# EAGLE design CSR8645-VFBGA275um-V1 (EAGLE 7.2.0)
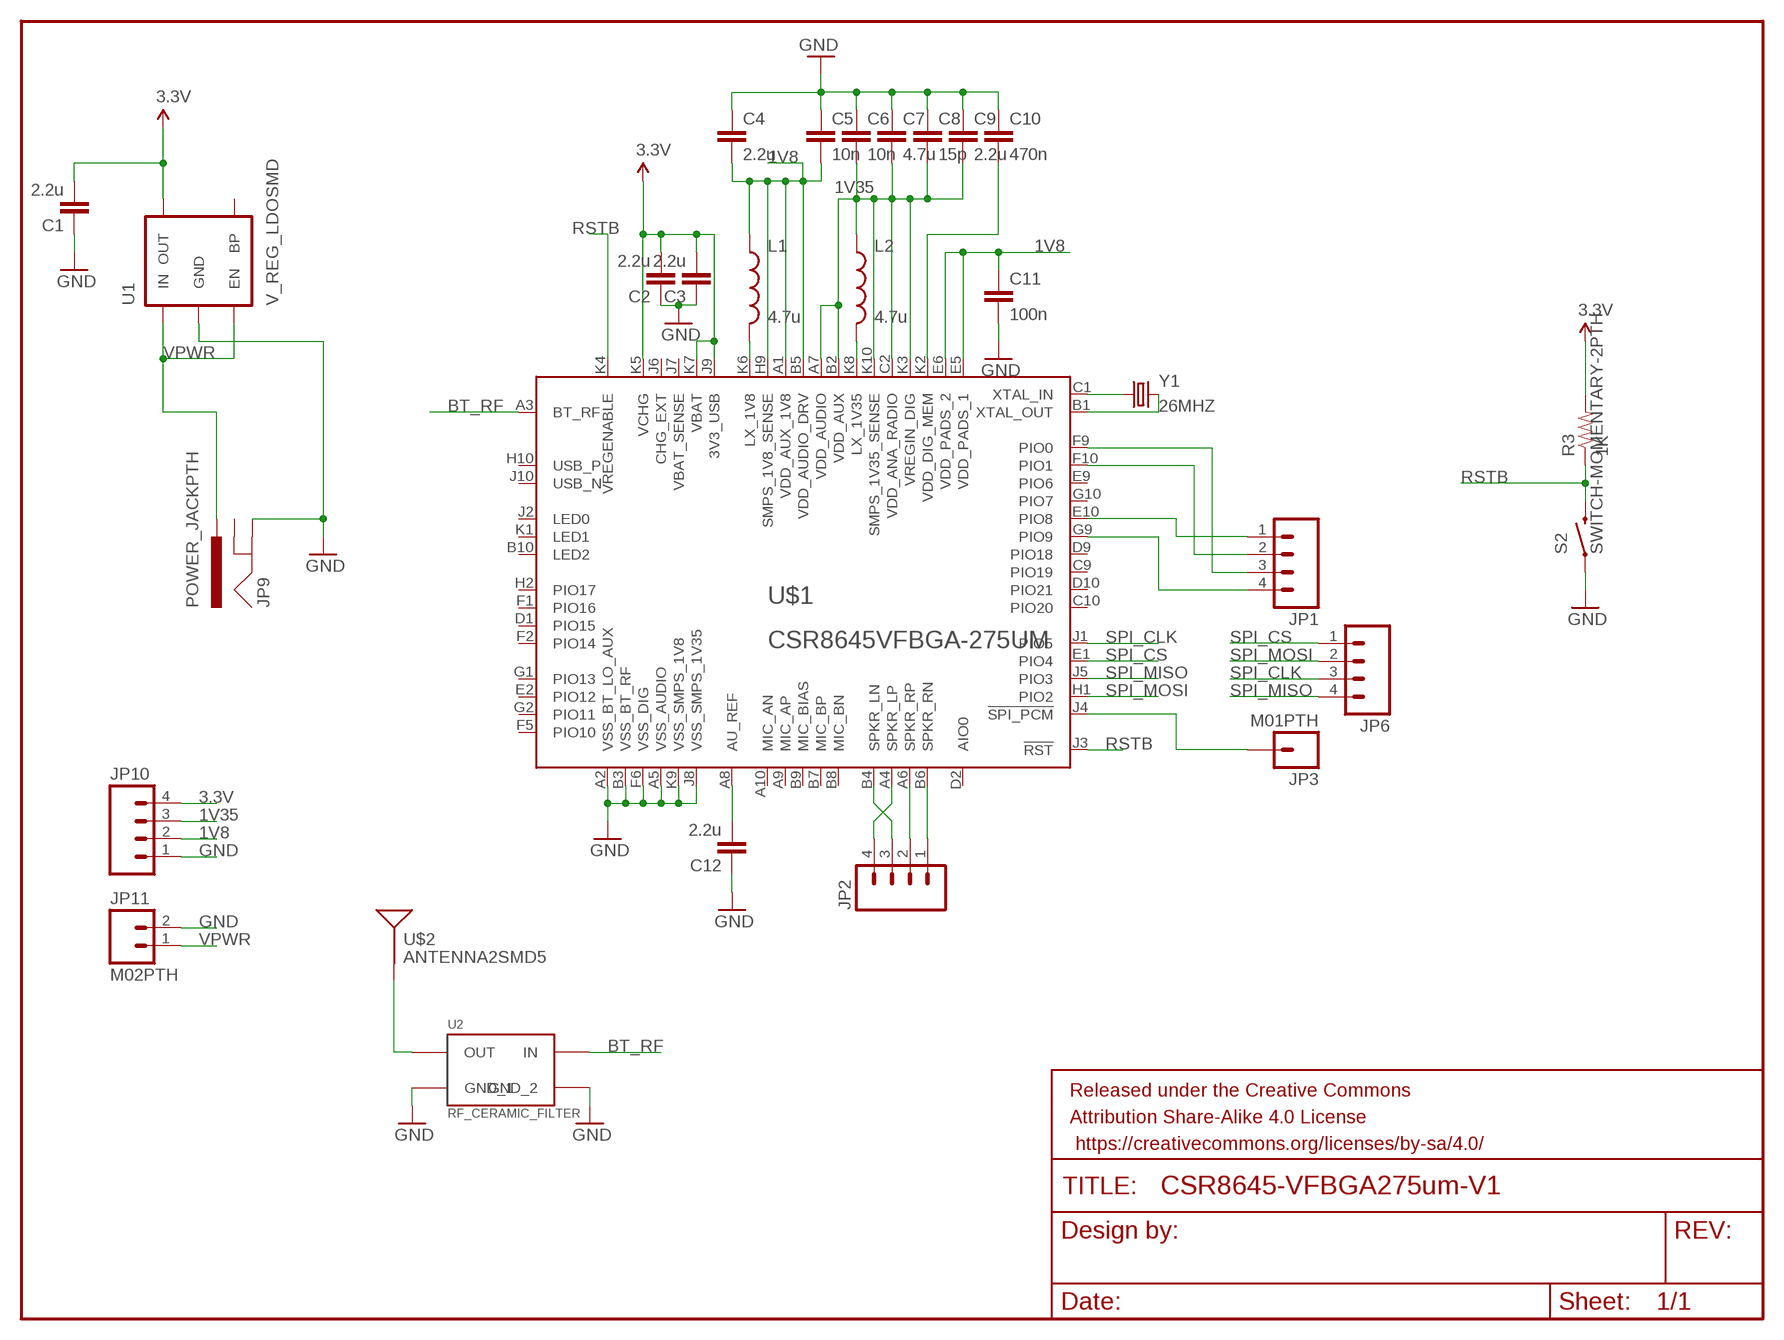
[diagram p0: schematic, sheet 1]

## Parts
C1  2.2u  CAPPTH  [CAP-PTH-SMALL]
C2  2.2u  CAPPTH  [CAP-PTH-SMALL]
C3  2.2u  CAPPTH  [CAP-PTH-SMALL]
C4  2.2u  CAPPTH  [CAP-PTH-SMALL]
C5  10n  CAPPTH  [CAP-PTH-SMALL]
C6  10n  CAPPTH  [CAP-PTH-SMALL]
C7  4.7u  CAPPTH  [CAP-PTH-SMALL]
C8  15p  CAPPTH  [CAP-PTH-SMALL]
C9  2.2u  CAPPTH  [CAP-PTH-SMALL]
C10  470n  CAPPTH  [CAP-PTH-SMALL]
C11  100n  CAPPTH  [CAP-PTH-SMALL]
C12  2.2u  CAPPTH  [CAP-PTH-SMALL]
FRAME1  FRAME-LETTER  [CREATIVE_COMMONS]
JP1  M04PTH  [1X04]
JP2  M04PTH  [1X04]
JP3  M01PTH  [1X01]
JP6  M04PTH  [1X04]
JP9  POWER_JACKPTH  [POWER_JACK_PTH]
JP10  M04PTH  [1X04]
JP11  M02PTH  [1X02]
L1  4.7u  INDUCTOR0805  [0805]
L2  4.7u  INDUCTOR0805  [0805]
R3  1K  RESISTOR0805-RES  [0805]
S2  SWITCH-MOMENTARY-2PTH  [TACTILE-PTH]
U1  V_REG_LDOSMD  [SOT23-5]
U2  RF_CERAMIC_FILTER  [RF_FILTER]
U$1  CSR8645VFBGA-275UM  [VFBGA68-LARGE]
U$2  ANTENNA2SMD5  [ANTENNA-CHIP5]
Y1  26MHZ  CRYSTALHC49US  [HC49US]

## Nets
1V8: C4.2 C5.2 C11.1 JP10.2 L1.1 U$1.A1(VDD_AUX_1V8) U$1.B5(VDD_AUDIO_DRV) U$1.E5(VDD_PADS_1) U$1.E6(VDD_PADS_2) U$1.H9(SMPS_1V8_SENSE)
1V35: C6.2 C7.2 C8.2 C9.2 JP10.3 L2.1 U$1.A7(VDD_AUDIO) U$1.B2(VDD_AUX) U$1.C2(VDD_ANA_RADIO) U$1.K3(VREGIN_DIG) U$1.K10(SMPS_1V35_SENSE)
3.3V: C1.2 C2.2 C3.2 JP10.4 R3.2 U1.5(OUT) U$1.J9(3V3_USB) U$1.K5(VCHG) U$1.K7(VBAT)
!SPI_PCM: JP3.1 U$1.J4(!SPI_PCM)
BT_RF: U2.4(IN) U$1.A3(BT_RF)
GND: C1.1 C2.1 C3.1 C4.1 C5.1 C6.1 C7.1 C8.1 C9.1 C10.1 C11.2 C12.1 JP9.GND JP10.1 JP11.2 S2.1 U1.2(GND) U2.1(GND_1) U2.3(GND_2) U$1.A2(VSS_BT_LO_AUX) U$1.A5(VSS_AUDIO) U$1.B3(VSS_BT_RF) U$1.F6(VSS_DIG) U$1.J8(VSS_SMPS_1V35) U$1.K9(VSS_SMPS_1V8)
N$1: JP1.3 U$1.F9(PIO0)
N$2: JP2.3 U$1.B4(SPKR_LN)
N$3: L1.2 U$1.K6(LX_1V8)
N$4: L2.2 U$1.K8(LX_1V35)
N$5: U$1.C1(XTAL_IN) Y1.1
N$6: C10.2 U$1.K2(VDD_DIG_MEM)
N$7: U$1.B1(XTAL_OUT) Y1.2
N$8: JP1.2 U$1.F10(PIO1)
N$9: JP1.1 U$1.E10(PIO8)
N$10: JP2.4 U$1.A4(SPKR_LP)
N$11: JP1.4 U$1.G9(PIO9)
N$12: JP2.2 U$1.A6(SPKR_RP)
N$13: U2.2(OUT) U$2.FEED(SIGNAL)
N$14: JP2.1 U$1.B6(SPKR_RN)
N$15: C12.2 U$1.A8(AU_REF)
RSTB: R3.1 S2.3 U$1.J3(!RST) U$1.K4(VREGENABLE)
SPI_CLK: JP6.3 U$1.J1(PIO5)
SPI_CS: JP6.1 U$1.E1(PIO4)
SPI_MISO: JP6.4 U$1.J5(PIO3)
SPI_MOSI: JP6.2 U$1.H1(PIO2)
VPWR: JP9.PWR JP11.1 U1.1(IN) U1.3(EN)
Unconnected: JP9.GNDBREAK U1.4(BP) U$1.A9(MIC_AP) U$1.A10(MIC_AN) U$1.B7(MIC_BP) U$1.B8(MIC_BN) U$1.B9(MIC_BIAS) U$1.B10(LED2) U$1.C9(PIO19) U$1.C10(PIO20) U$1.D1(PIO15) U$1.D2(AIO0) U$1.D9(PIO18) U$1.D10(PIO21) U$1.E2(PIO12) U$1.E9(PIO6) U$1.F1(PIO16) U$1.F2(PIO14) U$1.F5(PIO10) U$1.G1(PIO13) U$1.G2(PIO11) U$1.G10(PIO7) U$1.H2(PIO17) U$1.H10(USB_P) U$1.J2(LED0) U$1.J6(CHG_EXT) U$1.J7(VBAT_SENSE) U$1.J10(USB_N) U$1.K1(LED1)

## Library data of the parts
C1-C12 = SparkFun-Passives:CAP: Capacitor Standard 0603 ceramic capacitor, and 0.1" leaded capacitor.
FRAME1 = SparkFun-Aesthetics:FRAME-LETTER: Schematic Frame Standard 8.5x11 US Letter frame
JP1 JP2 JP6 JP10 = SparkFun-Connectors:M04: Header 4 Standard 4-pin 0.1" header. Use with straight break away headers (SKU : PRT-00116), right angle break away headers (PRT-00553), swiss pins (PRT-00743), machine pins (PRT-00117), and female headers (PRT-00115). Molex polarized connector foot print use with SKU : PRT-08231 with associated crimp pins and housings. 1MM SMD Version SKU: PRT-10208
JP3 = SparkFun-Connectors:M01: Header 1 Standard 1-pin 0.1" header. Use with straight break away headers (SKU : PRT-00116), right angle break away headers (PRT-00553), swiss pins (PRT-00743), machine pins (PRT-00117), and female headers (PRT-00115).
JP9 = SparkFun-Connectors:POWER_JACK: Power Jack This is the standard 5.5mm barrel jack for power. The PTH is the most common, proven, reliable, footprint. The Slot footprint only works if the mill layer is transmitted to the PCB fab house so be warned. Mating wall wart : TOL-00298 (and others); PROD_ID: CONN-08197
JP11 = SparkFun-Connectors:M02: Standard 2-pin 0.1" header. Use with - straight break away headers ( PRT-00116) - right angle break away headers (PRT-00553) - swiss pins (PRT-00743) - machine pins (PRT-00117) - female headers (PRT-00115) Molex polarized connector foot print use with: PRT-08233 with associated crimp pins and housings. 2.54_SCREWTERM for use with PRT-10571. 3.5mm Screw Terminal footprints for PRT-08084 5mm Screw Terminal footprints for use with PRT-08432
L1 L2 = SparkFun-Passives:INDUCTOR: Inductors Basic Inductor/Choke - 0603 and 1206. Footprints are not proven and vary greatly between part numbers. SRN6045- 33uH, 20% 1.4A SDR0403-560KL - 56uH, 10%, 500mA RMS/740mA peak
R3 = SparkFun-Resistors:RESISTOR: Resistor Basic schematic elements and footprints for 0603, 1206, and PTH resistors.
S2 = SparkFun-Electromechanical:SWITCH-MOMENTARY-2: Various NO switches- pushbuttons, reed, etc
U1 = SparkFun-PowerIC:V_REG_LDO: Voltage Regulator LDO Standard 150mA LDO voltage regulator in SOT-23 layout. Micrel part MIC5205. BP (by-pass) pin is used to lower output noise with 470pF cap.
U2 = SparkFun-RF:RF_CERAMIC_FILTER
U$1 = SparkFun-DigitalIC:CSR8645
U$2 = SparkFun-RF:ANTENNA2: Chip antenna Single endded antenna. Common with smaller chip antennas. CHIP4 package is the GPS Chip Antenna SKU: GPS-08418. CHIP5 package is 2.4GHz chip antenna SKU: WRL-00144.
Y1 = SparkFun-FreqCtrl:CRYSTAL: Various standard crystals. Proven footprints.

## Board
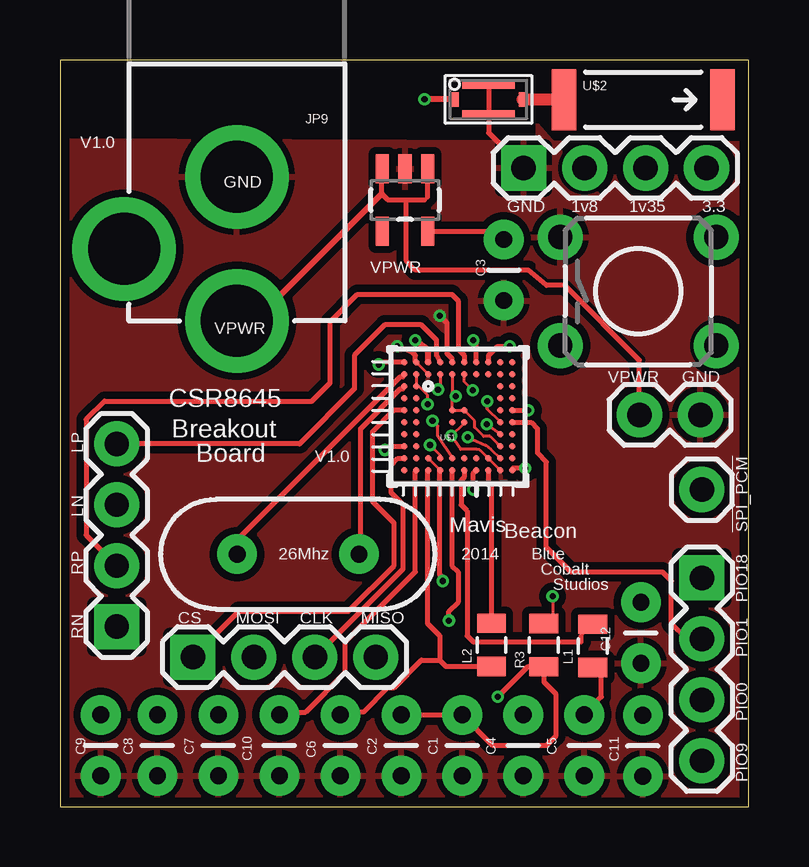
[diagram p1: board, top side]
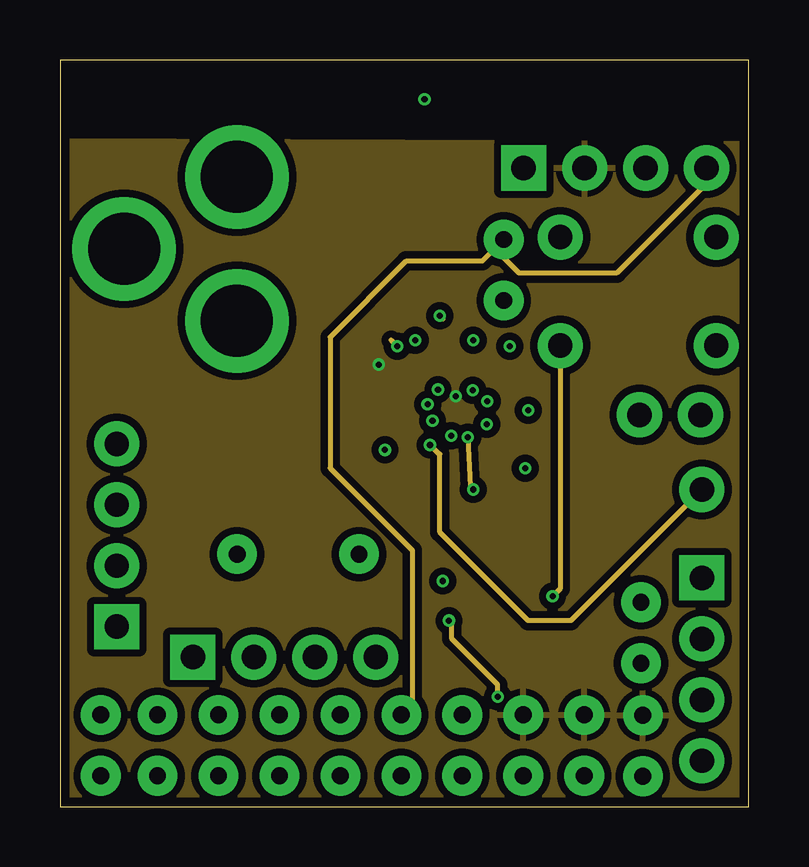
[diagram p2: board, inner layer Route2]
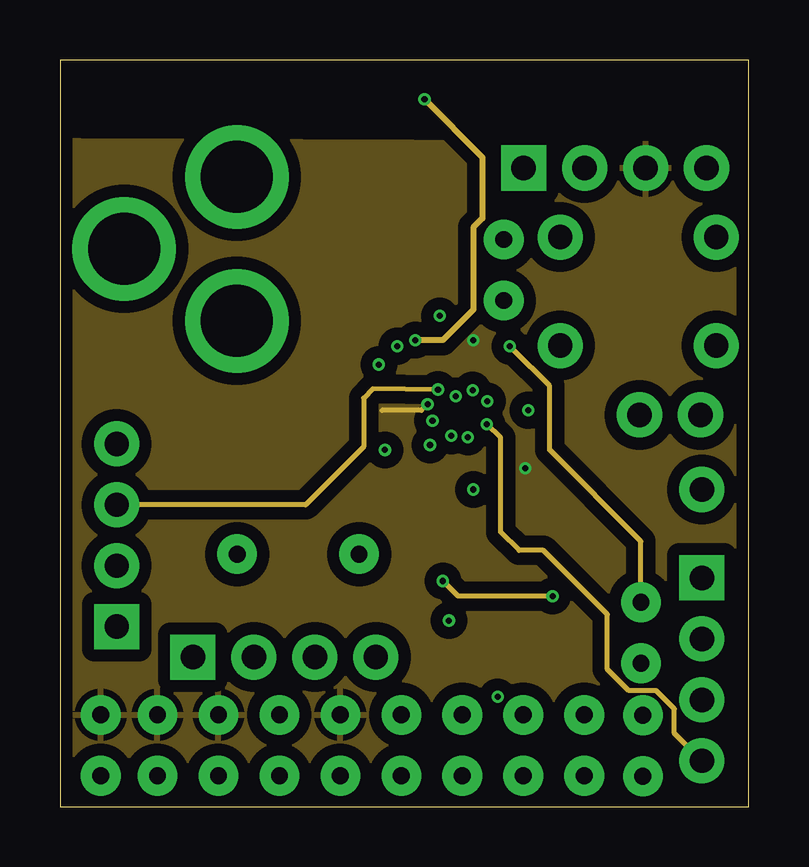
[diagram p3: board, inner layer Route15]
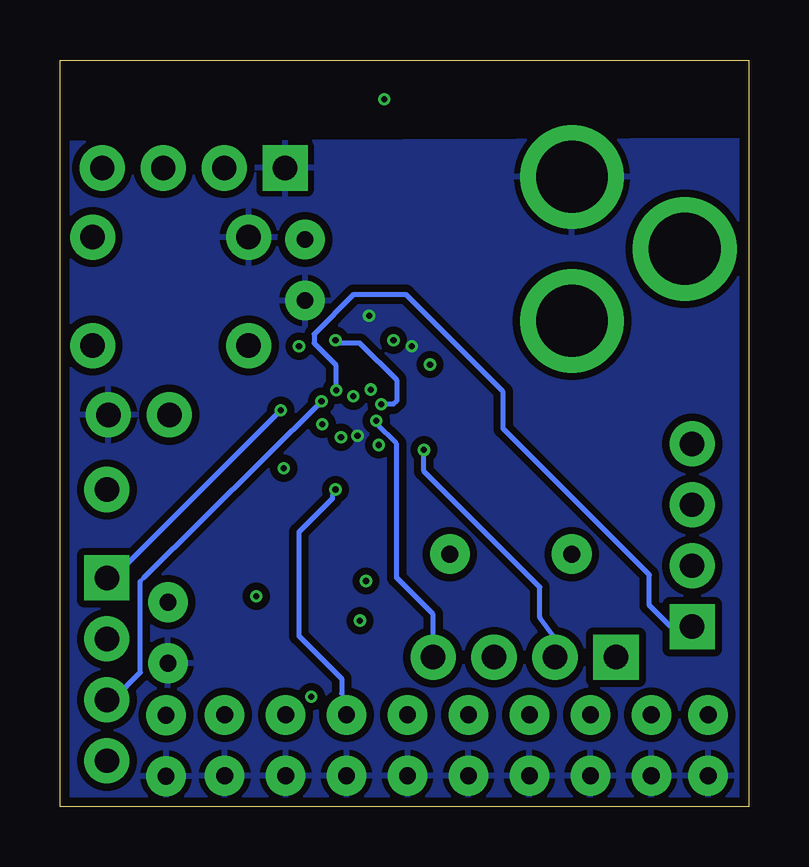
[diagram p4: board, bottom side, seen from below]

Size 28.7 x 31.11 mm. Coordinates in mm from the lower left corner, seen from the top.
Outline: 0,0 28.7,0 28.7,31.11 0,31.11 0,0
Copper layers (1*2*15*16): Top 0.035559375mm / dielectric 0.17018125mm / Route2 0.01778125mm / dielectric 47mil / Route15 0.01778125mm / dielectric 0.17018125mm / Bottom 0.035559375mm
Design rules "OSHPark-4layer *": minimum track width 5mil, minimum drill 10mil, track to track 6mil, track to pad 6mil, pad to pad 5mil, via to via 5mil, smd to smd 5mil, copper to edge 15mil, drill to drill 6mil, minimum pad ring 4mil, minimum via ring 5mil, stop-mask expansion 4mil, vias tented up to drill 25mil, thermal gap 10mil

### Footprints (pad centres in the part's own frame; a part is rotated, then mirrored left to right if it is on the bottom)
CAP-PTH-SMALL = drill 0.7 pad 1.651: 1 0,0; 2 2.54,0
1X04 = drill 1.016 pad 1.88 square: 1 0,0 | drill 1.016 pad 1.88: 2 2.54,0; 3 5.08,0; 4 7.62,0
1X01 = drill 1.016 pad 1.88: 1 0,0
POWER_JACK_PTH = drill 2.997 pad 4.318: GND 0,7.7; GNDBREAK 4.7,10.7; PWR 0,13.7
1X02 = drill 1.016 pad 1.88: 1 0,0; 2 2.54,0
0805 = smd 0.8 x 1.2: 1 -0.9,0; 2 0.9,0
TACTILE-PTH = drill 1.016 pad 1.88: 1 -3.251,2.261; 2 3.251,2.261; 3 -3.251,-2.261; 4 3.251,-2.261
SOT23-5 = smd 0.55 x 1.2: 1 -0.95,-1.3; 2 0,-1.3; 3 0.95,-1.3; 4 0.95,1.3; 5 -0.95,1.3
RF_FILTER = smd 2.2 x 0.35: 1 0,0.625; 3 0,-0.625 | smd 0.35 x 0.6: 2 1.425,0; 4 -1.425,0
VFBGA68-LARGE = smd 0.275 x 0.275: A1 -2.25,2.25; A2 -1.75,2.25; A3 -1.25,2.25; A4 -0.75,2.25; A5 -0.25,2.25; A6 0.25,2.25; A7 0.75,2.25; A8 1.25,2.25; A9 1.75,2.25; A10 2.25,2.25; B1 -2.25,1.75; B2 -1.75,1.75; B3 -1.25,1.75; B4 -0.75,1.75; B5 -0.25,1.75; B6 0.25,1.75; B7 0.75,1.75; B8 1.25,1.75; B9 1.75,1.75; B10 2.25,1.75; C1 -2.25,1.25; C2 -1.75,1.25; C9 1.75,1.25; C10 2.25,1.25; D1 -2.25,0.75; D2 -1.75,0.75; D9 1.75,0.75; D10 2.25,0.75; E1 -2.25,0.25; E2 -1.75,0.25; E5 -0.25,0.25; E6 0.25,0.25; E9 1.75,0.25; E10 2.25,0.25; F1 -2.25,-0.25; F2 -1.75,-0.25; F5 -0.25,-0.25; F6 0.25,-0.25; F9 1.75,-0.25; F10 2.25,-0.25; G1 -2.25,-0.75; G2 -1.75,-0.75; G9 1.75,-0.75; G10 2.25,-0.75; H1 -2.25,-1.25; H2 -1.75,-1.25; H9 1.75,-1.25; H10 2.25,-1.25; J1 -2.25,-1.75; J2 -1.75,-1.75; J3 -1.25,-1.75; J4 -0.75,-1.75; J5 -0.25,-1.75; J6 0.25,-1.75; J7 0.75,-1.75; J8 1.25,-1.75; J9 1.75,-1.75; J10 2.25,-1.75; K1 -2.25,-2.25; K2 -1.75,-2.25; K3 -1.25,-2.25; K4 -0.75,-2.25; K5 -0.25,-2.25; K6 0.25,-2.25; K7 0.75,-2.25; K8 1.25,-2.25; K9 1.75,-2.25; K10 2.25,-2.25
ANTENNA-CHIP5 = smd 1.016 x 2.54: FEED -3.302,0; NC 3.302,0
HC49US = drill 0.7 pad 1.651: 1 -2.54,0; 2 2.54,0

### Placement (x,y rotation side)
C1  16.76,1.28 90 top
C2  14.22,1.28 90 top
C3  18.49,21.08 90 top
C4  19.3,1.28 90 top
C5  21.84,1.28 90 top
C6  11.68,1.28 90 top
C7  6.6,1.28 90 top
C8  4.06,1.28 90 top
C9  1.7,1.28 90 top
C10  9.14,1.28 90 top
C11  24.28,3.8 270 top
C12  24.21,5.97 90 top
FRAME1  120.47,86.87 0 top  (outside the outline)
JP1  26.75,9.53 270 top
JP2  2.36,7.49 90 top
JP3  26.75,13.21 0 top
JP6  5.54,6.22 0 top
JP9  7.37,33.94 180 top
JP10  19.32,26.61 0 top
JP11  24.15,16.32 0 top
L1  22.2,6.69 90 top
L2  17.98,6.73 90 top
R3  20.16,6.72 270 top
S2  24.09,21.46 0 top
U1  14.38,25.27 180 top
U2  17.86,29.46 0 top
U$1  16.59,16.26 0 top
U$2  24.31,29.45 0 top
Y1  9.92,10.52 180 top

### Tracks (layer width: path | path; a pad name or v marks a point on that pad's centre or on a via)
1V8  (via drill 0.25 pad 0.1)
  Top 0.127: U$1.E6 U$1.E5 16.34,16.95 v16.48,17.09 16.34,17.24 U$1.B5 | U$1.E6 16.84,16.51 | 18.23,15.11 U$1.H9 17.92,15.42 17.65,15.42 17.27,15.8 17.27,16.07 U$1.E6 | 22.56,5.43 L1.1
  Top 0.203: C5.2 21.92,3.94 22.56,4.57 22.56,5.43 | 22.56,5.69 L1.1 | U$1.A1 13.38,18.51 v13.28,18.41
  pour Route2 (isolate 0.305): 0.08,27.81 28.65,27.69 28.65,0 0.2,0
1V35  (via drill 0.25)
  Top 0.127: U$1.B2 U$1.C2 14.94,17.53 15.32,17.14 v15.32,16.76 | 17.35,18.54 U$1.A7
  Top 0.203: v19.38,14.1 18.87,14.1 U$1.K10 | L2.1 17.35,5.84 16.08,5.84 15.82,6.1 | C6.2 11.76,3.94 12.65,3.94 13.67,4.95 13.92,4.95 15.06,6.1 15.82,6.1 | 15.82,6.1 15.82,7.11 15.32,7.62 15.32,13.99 U$1.K3 | 17.35,18.54 17.35,19.3 v17.22,19.43
  Route15 0.203: v15.32,16.76 15.06,16.51 13.41,16.51
  Bottom 0.203: v15.32,16.76 14.81,16.76 14.68,16.89 14.68,17.78 16.21,19.3 17.09,19.3 v17.22,19.43
  pour Route15 (isolate 0.508): 0.84,27.81 28.65,27.69 28.65,-0.13 0.2,-0.13 0.2,27.81
3.3V  (via drill 0.25, 0.25 pad 0.1)
  Top 0.127: 14.3,3.81 C2.2 | 16.71,3.81 C1.2 | v16.99,15.39 17.73,15.06 17.96,14.88 U$1.J9
  Top 0.203: v17.22,13.21 17.22,13.89 U$1.K7 | 16.71,3.81 14.3,3.81 | C1.2 18.04,2.54 20.27,2.54 20.65,2.92 20.65,4.7 20.16,5.19 R3.2 19.49,5.82 v18.24,4.57 | U1.5 18.14,23.97 C3.2 | v16.21,7.75 16.21,8.13 16.59,8.51 16.59,9.78 16.33,10.03 16.33,13.97 16.34,13.97 U$1.K5
  Route2 0.127: 17.09,13.33 v17.22,13.21 | JP10.4 26.94,25.97
  Route2 0.203: v16.99,15.39 17.09,13.33 | 26.94,25.97 23.19,22.22 19.13,22.22 18.49,22.86 C3.2 17.6,22.73 14.43,22.73 11.25,19.56 11.25,14.1 14.68,10.67 14.68,4.32 14.22,3.86 C2.2 | v18.24,4.57 18.24,5.08 16.33,6.98 16.33,7.62 v16.21,7.75
  Bottom 0.127: 16.97,4.7 16.84,4.57
  Bottom 0.203: 16.84,4.57 16.84,3.94 C1.2 | 16.97,4.7 16.97,5.33 18.75,7.11 18.75,11.43 17.35,12.83 17.35,12.95 17.22,13.08 v17.22,13.21
!SPI_PCM  (via drill 0.25)
  Top 0.127: v15.42,15.06 15.84,14.64 U$1.J4
  Route2 0.203: JP3.1 21.29,7.75 19.51,7.75 15.82,11.43 15.82,14.68 15.8,14.68 v15.42,15.06
BT_RF  (via drill 0.25)
  Top 0.254: U2.4 v15.19,29.46 | v14.81,19.43 15.32,19.05 15.32,18.53 U$1.A3
  Route15 0.254: v15.19,29.46 17.6,27.05 17.6,24.51 17.22,24.13 17.22,20.7 15.95,19.43 v14.81,19.43
GND  (via drill 0.25, 0.25 pad 0.1)
  Top 0.127: U$1.J8 | U$1.F6 | U$1.B3 U$1.A2 14.81,18.53 | U$1.J8 U$1.K9 | U$1.F6 | U1.2 14.38,26.59 14.3,26.67 | U$1.J8 17.48,14.86 17.37,14.88 16.69,14.88 v16.31,15.44 | v16.31,15.44 16.84,15.97 U$1.F6 | v16.31,15.44 16.33,15.42 | 16.31,15.39 v16.31,15.44
  Top 0.203: U2.1 U2.3 17.86,28.07 JP10.1 | 14.81,18.53 14.81,18.8 14.68,18.92 v14.05,19.18 | U$1.A5 16.34,18.66 16.13,18.87 16.13,20.14 v15.82,20.45
  Route2 0.203: 13.79,19.43 v14.05,19.18 | 16.31,15.49 16.33,15.49 16.33,15.47 v16.31,15.44 | v15.82,20.45 15.95,20.32
  pour Bottom (isolate 0.305): 0.2,27.81 28.65,27.69 28.65,-0.13 0.2,-0.13
  pour Top (isolate 0.305): 0.08,27.81 28.78,27.69 28.78,-0.13 0.08,0
  pour Top: 28.65,18.41 19.89,18.41 19.89,28.45
N$1  (via drill 0.25 pad 0.1)
  Top 0.127: U$1.F9 18.34,16.03 17.81,16.56 v17.81,16.89
  Bottom 0.127: 25.35,9.4 25.22,9.53
  Bottom 0.203: v17.81,16.89 25.22,9.53 | JP1.3 26.49,4.45 25.35,5.59 25.35,9.4
N$2  (via drill 0.25 pad 0.1)
  Top 0.127: U$1.B4 15.84,17.41 15.8,17.37 v15.75,17.37
  Route15 0.203: JP2.3 10.24,12.57 12.65,14.99 12.65,17.02 13.03,17.4 v15.75,17.37
N$3
  Top 0.127: 21.71,7.11 L1.2
  Top 0.203: 21.71,7.11 21.71,6.86 17.22,6.86 16.97,7.11 16.97,12.32 16.71,12.57 16.71,13.59 16.84,13.71 U$1.K6
N$4
  Top 0.203: L2.2 17.98,13.33 17.86,13.46 17.86,13.99 U$1.K8
N$5
  Top 0.203: U$1.C1 14.3,17.4 14.17,17.4 12.52,15.75 12.52,10.54 Y1.1
N$6
  Top 0.127: 14.81,13.97 U$1.K2 14.81,13.98
  Top 0.203: C10.2 9.22,3.94 10.24,3.94 11.89,5.59 11.89,6.86 14.81,9.78 14.81,13.98
N$7
  Top 0.127: 14.17,17.91 14.3,17.91
  Top 0.203: 14.17,17.91 7.44,11.18 7.44,10.54 Y1.2 | 14.3,17.91 U$1.B1
N$8
  Top 0.127: 18.87,16 U$1.F10 18.87,16
  Top 0.203: JP1.2 26.11,6.98 25.48,7.62 25.48,9.4 25.1,9.78 21.29,9.78 20.27,10.79 20.27,14.35 19.89,14.73 19.89,15.75 19.63,16 18.87,16
N$9  (via drill 0.25)
  Top 0.127: 19.38,16.51 19.51,16.64
  Top 0.203: U$1.E10 19.38,16.51 | v19.51,16.51 19.51,16.64
  Bottom 0.203: v19.51,16.51 26.49,9.53 JP1.1
N$10
  Top 0.127: 15.82,18.54 U$1.A4
  Top 0.203: JP2.4 9.98,15.11 12.27,17.4 12.27,18.8 13.54,20.07 15.06,20.07 15.7,19.43 15.7,18.8 U$1.A4
N$11  (via drill 0.25 pad 0.1)
  Top 0.127: U$1.G9 18.34,15.52 v17.78,15.93
  Route15 0.203: JP1.4 25.6,3.05 25.6,4.06 24.84,4.83 23.7,4.83 22.81,5.71 22.81,8 20.14,10.67 19.13,10.67 18.36,11.43 18.36,15.37 v17.78,15.93
N$12
  Top 0.127: U$1.A6
  Top 0.203: JP2.2 1.09,11.3 1.09,16.13 1.85,16.89 10.49,16.89 11.25,17.65 11.25,20.19 12.4,21.34 16.33,21.34 16.59,21.08 16.59,19.05 16.84,18.8 U$1.A6
N$13
  Top 0.508: U2.2 U$2.FEED
N$14  (via drill 0.25)
  Top 0.127: 16.84,17.91 U$1.B6 16.84,17.71 v17.2,17.35
  Bottom 0.203: JP2.1 3.25,7.49 4.14,8.38 4.14,9.65 10.24,15.75 10.24,17.27 14.3,21.34 16.46,21.34 18.11,19.68 18.11,19.3 17.22,18.41 17.22,17.37 v17.2,17.35
N$15  (via drill 0.25)
  Top 0.127: v18.75,19.18 18.49,19.18 | 17.86,18.54 U$1.A8
  Top 0.203: 17.86,18.54 17.86,18.8 18.24,19.18 v18.75,19.18
  Route15 0.127: 18.87,19.05 18.75,19.05
  Route15 0.203: C12.2 24.21,11.05 20.4,14.86 20.4,17.53 18.87,19.05 | v18.75,19.18 18.75,19.05
RSTB  (via drill 0.25, 0.25 pad 0.1)
  Top 0.127: U$1.J3 U$1.K4 | v20.52,8.76 20.52,7.99 R3.1
  Top 0.203: v15.95,9.4 15.95,9.53 15.82,9.65 15.82,13.99 U$1.K4
  Route2 0.203: S2.3 20.84,9.08 v20.52,8.76
  Route15 0.203: v20.52,8.76 16.59,8.76 v15.95,9.4
SPI_CLK
  Top 0.127: 14.3,14.48 U$1.J1
  Top 0.203: JP6.3 14.3,9.91 14.3,12.57 13.79,13.08 13.79,14.22 14.07,14.51 U$1.J1
SPI_CS
  Top 0.203: JP6.1 7.44,8.13 12.01,8.13 13.92,10.03 13.92,11.81 13.03,12.7 13.03,15.62 13.92,16.51 U$1.E1
SPI_MISO  (via drill 0.25)
  Top 0.127: U$1.J5 16.34,14.53 15.75,15.42 15.75,15.85 v15.52,16.08
  Bottom 0.203: JP6.4 13.16,8 14.68,9.53 14.68,15.11 15.52,15.95 v15.52,16.08
SPI_MOSI  (via drill 0.25)
  Top 0.127: 14.3,14.99 U$1.H1
  Top 0.203: U$1.H1 13.69,15.01 v13.54,14.86
  Bottom 0.203: JP6.2 8.08,6.98 8.71,7.87 8.71,9.14 13.54,13.97 v13.54,14.86
VPWR
  Top 0.127: 13.54,26.92 13.54,26.67 U1.3 13.41,26.54 | 15.44,26.67 U1.1 | 15.44,26.29 15.44,26.54 U1.1 | 15.32,26.56 U1.1 | 15.19,25.27 15.32,25.4
  Top 0.203: 13.41,26.54 13.41,25.53 13.67,25.27 14.43,25.27 | 14.43,25.27 15.19,25.27 | 15.32,25.4 15.32,26.56 | JP11.1 24.15,18.6 21.03,21.72 20.27,21.72 19.51,22.35 14.81,22.35 14.43,22.73 14.43,25.27
  Top 0.254: JP9.PWR 8.12,20.24 13.41,25.53

### Text on the board
tPlace: V1.0 | GND | GND | 1v8 | 1v35 | 3.3 | VPWR | VPWR | VPWR | GND | CSR8645 | Breakout | LP | Board | V1.0 | LN | Mavis | Beacon | !SPI_PCM | 26Mhz | 2014 | Blue | RP | Cobalt | Studios | PIO18 | RN | CS | MOSI | CLK | MISO | PIO1 | PIO0 | PIO9